# EAGLE schematic Calciatore Rev.2 DOWN (EAGLE 7.2.0)

## Sheet 1 of 3
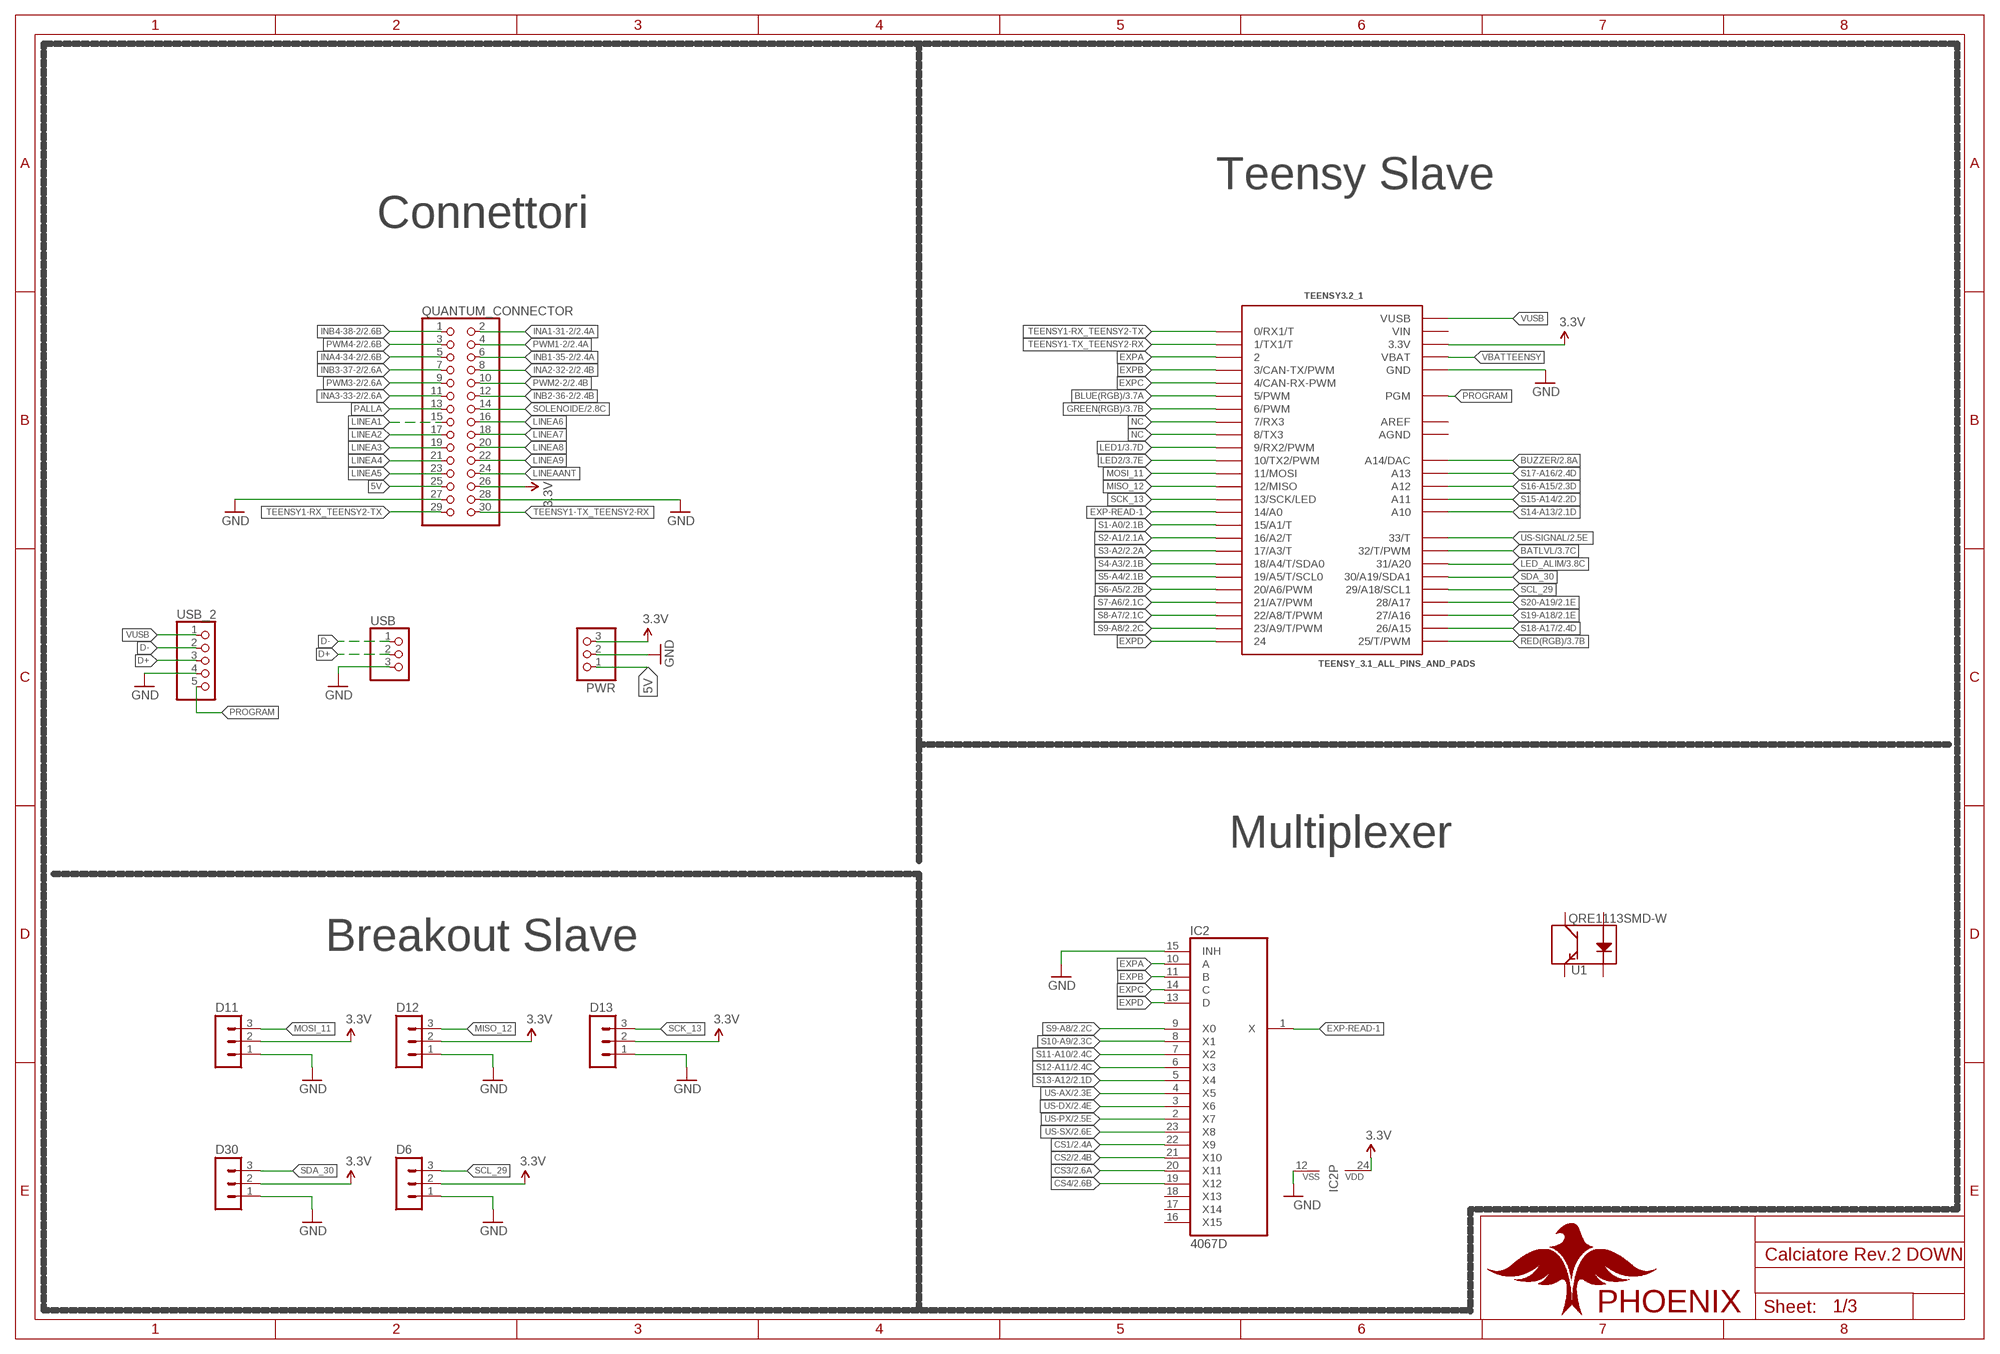
[diagram p0: schematic, sheet 1]

### Parts
D6  MA03-1  [MA03-1]
D11  MA03-1  [MA03-1]
D12  MA03-1  [MA03-1]
D13  MA03-1  [MA03-1]
D30  MA03-1  [MA03-1]
IC2  4067D  [SO24W]
PWR  PINHD-1X3  [1X03]
QUANTUM_CONNECTOR  PINHD-2X15  [2X15]
TEENSY3.2_1  TEENSY_3.1_ALL_PINS_AND_PADS  [TEENSY3_ALL_PINS_&_PADS]
U1  QRE1113SMD-W  [QRE1113-W]
USB  PINHD-1X3  [1X03]
USB_2  PINHD-1X5  [1X05]

### Nets
3.3V [power usb]: D6.2 D11.2 D12.2 D13.2 D30.2 IC2.24(VDD) PWR.3 QUANTUM_CONNECTOR.26 TEENSY3.2_1.3.3V TEENSY3.2_1.3.3V1(3.3V) TEENSY3.2_1.3.3V2(3.3V) ; also sheet 2,3
5V: PWR.1 QUANTUM_CONNECTOR.25 ; also sheet 3
BATLVL: TEENSY3.2_1.32(32/T/PWM) ; also sheet 3
BLUE(RGB): TEENSY3.2_1.5(5/PWM) ; also sheet 3
BUZZER: TEENSY3.2_1.RESET/DAC(A14/DAC) ; also sheet 2
CS1: IC2.22(X9) ; also sheet 2
CS2: IC2.21(X10) ; also sheet 2
CS3: IC2.20(X11) ; also sheet 2
CS4: IC2.19(X12) ; also sheet 2
D+: USB.2 USB_2.3
D-: USB.1 USB_2.2
EXP-READ-1: IC2.1(X) TEENSY3.2_1.14/A0
EXPA: IC2.10(A) TEENSY3.2_1.2
EXPB: IC2.11(B) TEENSY3.2_1.3(3/CAN-TX/PWM)
EXPC: IC2.14(C) TEENSY3.2_1.4(4/CAN-RX-PWM)
EXPD: IC2.13(D) TEENSY3.2_1.24
GND [gnd]: D6.1 D11.1 D12.1 D13.1 D30.1 IC2.12(VSS) IC2.15(INH) PWR.2 QUANTUM_CONNECTOR.27 QUANTUM_CONNECTOR.28 TEENSY3.2_1.GND TEENSY3.2_1.GND1(GND) TEENSY3.2_1.GND2(GND) USB.3 USB_2.4 ; also sheet 2,3
GREEN(RGB): TEENSY3.2_1.6(6/PWM) ; also sheet 3
INA1-31-2: QUANTUM_CONNECTOR.2 ; also sheet 2
INA2-32-2: QUANTUM_CONNECTOR.8 ; also sheet 2
INA3-33-2: QUANTUM_CONNECTOR.11 ; also sheet 2
INA4-34-2: QUANTUM_CONNECTOR.5 ; also sheet 2
INB1-35-2: QUANTUM_CONNECTOR.6 ; also sheet 2
INB2-36-2: QUANTUM_CONNECTOR.12 ; also sheet 2
INB3-37-2: QUANTUM_CONNECTOR.7 ; also sheet 2
INB4-38-2: QUANTUM_CONNECTOR.1 ; also sheet 2
LED1: TEENSY3.2_1.9(9/RX2/PWM) ; also sheet 3
LED2: TEENSY3.2_1.10(10/TX2/PWM) ; also sheet 3
LED_ALIM: TEENSY3.2_1.31(31/A20) ; also sheet 3
LINEA1: QUANTUM_CONNECTOR.15
LINEA2: QUANTUM_CONNECTOR.17
LINEA3: QUANTUM_CONNECTOR.19
LINEA4: QUANTUM_CONNECTOR.21
LINEA5: QUANTUM_CONNECTOR.23
LINEA6: QUANTUM_CONNECTOR.16
LINEA7: QUANTUM_CONNECTOR.18
LINEA8: QUANTUM_CONNECTOR.20
LINEA9: QUANTUM_CONNECTOR.22
LINEAANT: QUANTUM_CONNECTOR.24
MISO_12: D12.3 TEENSY3.2_1.12(12/MISO)
MOSI_11: D11.3 TEENSY3.2_1.11(11/MOSI)
NC: TEENSY3.2_1.7(7/RX3) TEENSY3.2_1.8(8/TX3)
PALLA: QUANTUM_CONNECTOR.13
PROGRAM: TEENSY3.2_1.PGM USB_2.5
PWM1-2: QUANTUM_CONNECTOR.4 ; also sheet 2
PWM2-2: QUANTUM_CONNECTOR.10 ; also sheet 2
PWM3-2: QUANTUM_CONNECTOR.9 ; also sheet 2
PWM4-2: QUANTUM_CONNECTOR.3 ; also sheet 2
RED(RGB): TEENSY3.2_1.25(25/T/PWM) ; also sheet 3
S1-A0: TEENSY3.2_1.15/A1(15/A1/T) ; also sheet 2
S2-A1: TEENSY3.2_1.16/A2(16/A2/T) ; also sheet 2
S3-A2: TEENSY3.2_1.17/A3(17/A3/T) ; also sheet 2
S4-A3: TEENSY3.2_1.18/A4(18/A4/T/SDA0) ; also sheet 2
S5-A4: TEENSY3.2_1.19/A5(19/A5/T/SCL0) ; also sheet 2
S6-A5: TEENSY3.2_1.20/A6(20/A6/PWM) ; also sheet 2
S7-A6: TEENSY3.2_1.21/A7(21/A7/PWM) ; also sheet 2
S8-A7: TEENSY3.2_1.22/A8(22/A8/T/PWM) ; also sheet 2
S9-A8: IC2.9(X0) TEENSY3.2_1.23/A9(23/A9/T/PWM) ; also sheet 2
S10-A9: IC2.8(X1) ; also sheet 2
S11-A10: IC2.7(X2) ; also sheet 2
S12-A11: IC2.6(X3) ; also sheet 2
S13-A12: IC2.5(X4) ; also sheet 2
S14-A13: TEENSY3.2_1.A10 ; also sheet 2
S15-A14: TEENSY3.2_1.A11 ; also sheet 2
S16-A15: TEENSY3.2_1.A12 ; also sheet 2
S17-A16: TEENSY3.2_1.A13 ; also sheet 2
S18-A17: TEENSY3.2_1.26(26/A15) ; also sheet 2
S19-A18: TEENSY3.2_1.27(27/A16) ; also sheet 2
S20-A19: TEENSY3.2_1.28(28/A17) ; also sheet 2
SCK_13: D13.3 TEENSY3.2_1.13(13/SCK/LED)
SCL_29: D6.3 TEENSY3.2_1.29(29/A18/SCL1)
SDA_30: D30.3 TEENSY3.2_1.30(30/A19/SDA1)
SOLENOIDE: QUANTUM_CONNECTOR.14 ; also sheet 2
TEENSY1-RX_TEENSY2-TX: QUANTUM_CONNECTOR.29 TEENSY3.2_1.0(0/RX1/T)
TEENSY1-TX_TEENSY2-RX: QUANTUM_CONNECTOR.30 TEENSY3.2_1.1(1/TX1/T)
US-AX: IC2.4(X5) ; also sheet 2
US-DX: IC2.3(X6) ; also sheet 2
US-PX: IC2.2(X7) ; also sheet 2
US-SIGNAL: TEENSY3.2_1.33(33/T) ; also sheet 2
US-SX: IC2.23(X8) ; also sheet 2
VBATTEENSY: TEENSY3.2_1.VBAT
VUSB: TEENSY3.2_1.VUSB USB_2.1
Unconnected: IC2.16(X15) IC2.17(X14) IC2.18(X13) U1.1(A) U1.2(K) U1.3(C) U1.4(E)

### Notes on the sheet
- Teensy Slave
- Connettori
- Multiplexer
- Breakout Slave
- PHOENIX

## Sheet 2 of 3
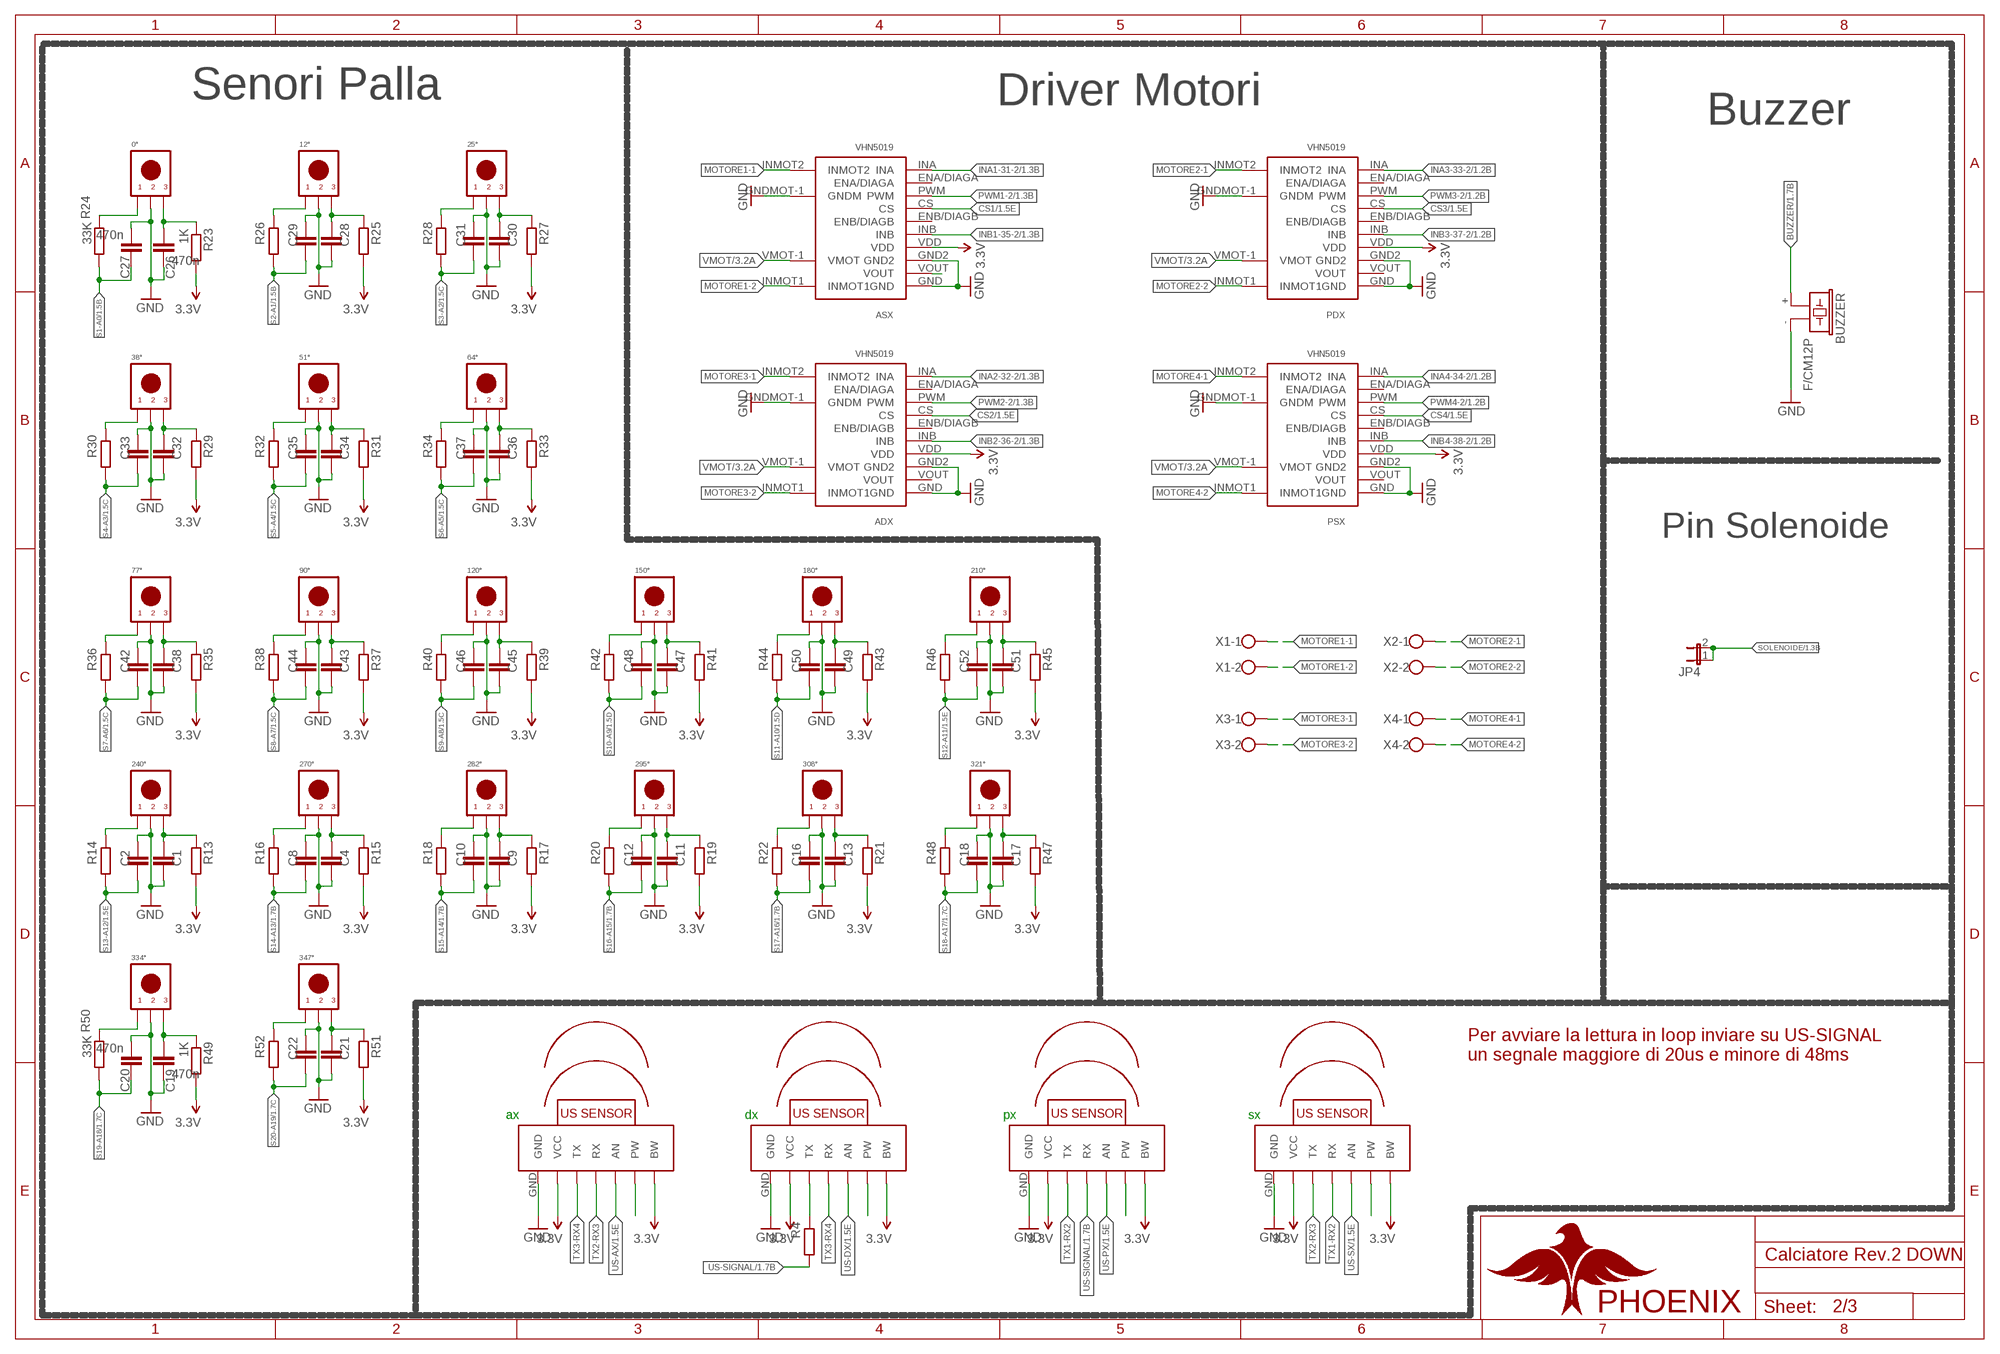
[diagram p1: schematic, sheet 2]

### Parts
0°  effe  TSOP4840  [TSOP4840]
12°  effe  TSOP4840  [TSOP4840]
25°  effe  TSOP4840  [TSOP4840]
38°  effe  TSOP4840  [TSOP4840]
51°  effe  TSOP4840  [TSOP4840]
64°  effe  TSOP4840  [TSOP4840]
77°  effe  TSOP4840  [TSOP4840]
90°  effe  TSOP4840  [TSOP4840]
120°  effe  TSOP4840  [TSOP4840]
150°  effe  TSOP4840  [TSOP4840]
180°  effe  TSOP4840  [TSOP4840]
210°  effe  TSOP4840  [TSOP4840]
240°  effe  TSOP4840  [TSOP4840]
270°  effe  TSOP4840  [TSOP4840]
282°  effe  TSOP4840  [TSOP4840]
295°  effe  TSOP4840  [TSOP4840]
308°  effe  TSOP4840  [TSOP4840]
321°  effe  TSOP4840  [TSOP4840]
334°  effe  TSOP4840  [TSOP4840]
347°  effe  TSOP4840  [TSOP4840]
ADX  VHN5019  [MOTOR-SHIELD]
ASX  VHN5019  [MOTOR-SHIELD]
AX  MB1010  [MB1010]
BUZZER  F/CM12P  [F/CM12P]
C1  C-EUC1206  [C1206]
C2  C-EUC1206  [C1206]
C4  C-EUC1206  [C1206]
C8  C-EUC1206  [C1206]
C9  C-EUC1206  [C1206]
C10  C-EUC1206  [C1206]
C11  C-EUC1206  [C1206]
C12  C-EUC1206  [C1206]
C13  C-EUC1206  [C1206]
C16  C-EUC1206  [C1206]
C17  C-EUC1206  [C1206]
C18  C-EUC1206  [C1206]
C19  470n  C-EUC1206  [C1206]
C20  470n  C-EUC1206  [C1206]
C21  C-EUC1206  [C1206]
C22  C-EUC1206  [C1206]
C26  470n  C-EUC1206  [C1206]
C27  470n  C-EUC1206  [C1206]
C28  C-EUC1206  [C1206]
C29  C-EUC1206  [C1206]
C30  C-EUC1206  [C1206]
C31  C-EUC1206  [C1206]
C32  C-EUC1206  [C1206]
C33  C-EUC1206  [C1206]
C34  C-EUC1206  [C1206]
C35  C-EUC1206  [C1206]
C36  C-EUC1206  [C1206]
C37  C-EUC1206  [C1206]
C38  C-EUC1206  [C1206]
C42  C-EUC1206  [C1206]
C43  C-EUC1206  [C1206]
C44  C-EUC1206  [C1206]
C45  C-EUC1206  [C1206]
C46  C-EUC1206  [C1206]
C47  C-EUC1206  [C1206]
C48  C-EUC1206  [C1206]
C49  C-EUC1206  [C1206]
C50  C-EUC1206  [C1206]
C51  C-EUC1206  [C1206]
C52  C-EUC1206  [C1206]
DX  MB1010  [MB1010]
JP4  JP1E  [JP1]
PDX  VHN5019  [MOTOR-SHIELD]
PSX  VHN5019  [MOTOR-SHIELD]
PX  MB1010  [MB1010]
R4  R-EU_M1206  [M1206]
R13  R-EU_M1206  [M1206]
R14  R-EU_M1206  [M1206]
R15  R-EU_M1206  [M1206]
R16  R-EU_M1206  [M1206]
R17  R-EU_M1206  [M1206]
R18  R-EU_M1206  [M1206]
R19  R-EU_M1206  [M1206]
R20  R-EU_M1206  [M1206]
R21  R-EU_M1206  [M1206]
R22  R-EU_M1206  [M1206]
R23  1K  R-EU_M1206  [M1206]
R24  33K  R-EU_M1206  [M1206]
R25  R-EU_M1206  [M1206]
R26  R-EU_M1206  [M1206]
R27  R-EU_M1206  [M1206]
R28  R-EU_M1206  [M1206]
R29  R-EU_M1206  [M1206]
R30  R-EU_M1206  [M1206]
R31  R-EU_M1206  [M1206]
R32  R-EU_M1206  [M1206]
R33  R-EU_M1206  [M1206]
R34  R-EU_M1206  [M1206]
R35  R-EU_M1206  [M1206]
R36  R-EU_M1206  [M1206]
R37  R-EU_M1206  [M1206]
R38  R-EU_M1206  [M1206]
R39  R-EU_M1206  [M1206]
R40  R-EU_M1206  [M1206]
R41  R-EU_M1206  [M1206]
R42  R-EU_M1206  [M1206]
R43  R-EU_M1206  [M1206]
R44  R-EU_M1206  [M1206]
R45  R-EU_M1206  [M1206]
R46  R-EU_M1206  [M1206]
R47  R-EU_M1206  [M1206]
R48  R-EU_M1206  [M1206]
R49  1K  R-EU_M1206  [M1206]
R50  33K  R-EU_M1206  [M1206]
R51  R-EU_M1206  [M1206]
R52  R-EU_M1206  [M1206]
SX  MB1010  [MB1010]
X1  W237-102  [W237-102]
X2  W237-102  [W237-102]
X3  W237-102  [W237-102]
X4  W237-102  [W237-102]

### Nets
3.3V [power usb]: ADX.VDD ASX.VDD AX.BW AX.VCC DX.BW DX.VCC PDX.VDD PSX.VDD PX.BW PX.VCC R13.2 R15.2 R17.2 R19.2 R21.2 R23.2 R25.2 R27.2 R29.2 R31.2 R33.2 R35.2 R37.2 R39.2 R41.2 R43.2 R45.2 R47.2 R49.2 R51.2 SX.BW SX.VCC ; also sheet 1,3
BUZZER: BUZZER.+ ; also sheet 1
CS1: ASX.CS ; also sheet 1
CS2: ADX.CS ; also sheet 1
CS3: PDX.CS ; also sheet 1
CS4: PSX.CS ; also sheet 1
GND [gnd]: 0°.GND 12°.GND 25°.GND 38°.GND 51°.GND 64°.GND 77°.GND 90°.GND 120°.GND 150°.GND 180°.GND 210°.GND 240°.GND 270°.GND 282°.GND 295°.GND 308°.GND 321°.GND 334°.GND 347°.GND ADX.GND ADX.GND2 ADX.GNDMOT-1(GNDM) ASX.GND ASX.GND2 ASX.GNDMOT-1(GNDM) AX.GND BUZZER.- C1.2 C2.1 C4.2 C8.1 C9.2 C10.1 C11.2 C12.1 C13.2 C16.1 C17.2 C18.1 C19.2 C20.2 C21.2 C22.1 C26.2 C27.2 C28.2 C29.1 C30.2 C31.1 C32.2 C33.1 C34.2 C35.1 C36.2 C37.1 C38.2 C42.1 C43.2 C44.1 C45.2 C46.1 C47.2 C48.1 C49.2 C50.1 C51.2 C52.1 DX.GND PDX.GND PDX.GND2 PDX.GNDMOT-1(GNDM) PSX.GND PSX.GND2 PSX.GNDMOT-1(GNDM) PX.GND SX.GND ; also sheet 1,3
INA1-31-2: ASX.INA ; also sheet 1
INA2-32-2: ADX.INA ; also sheet 1
INA3-33-2: PDX.INA ; also sheet 1
INA4-34-2: PSX.INA ; also sheet 1
INB1-35-2: ASX.INB ; also sheet 1
INB2-36-2: ADX.INB ; also sheet 1
INB3-37-2: PDX.INB ; also sheet 1
INB4-38-2: PSX.INB ; also sheet 1
MOTORE1-1: ASX.INMOT2 X1.1
MOTORE1-2: ASX.INMOT1 X1.2
MOTORE2-1: PDX.INMOT2 X2.1
MOTORE2-2: PDX.INMOT1 X2.2
MOTORE3-1: ADX.INMOT2 X3.1
MOTORE3-2: ADX.INMOT1 X3.2
MOTORE4-1: PSX.INMOT2 X4.1
MOTORE4-2: PSX.INMOT1 X4.2
N$3: 0°.VCC C26.1 R23.1
N$4: 0°.OUT R24.1
N$6: 12°.VCC C28.1 R25.1
N$7: 12°.OUT R26.1
N$9: 240°.VCC C1.1 R13.1
N$12 [power usb]: PX.PW
N$13: 270°.VCC C4.1 R15.1
N$14: 282°.VCC C9.1 R17.1
N$15: 25°.OUT R28.1
N$16: 38°.OUT R30.1
N$18: 51°.OUT R32.1
N$20: 25°.VCC C30.1 R27.1
N$24: 295°.VCC C11.1 R19.1
N$25: 308°.VCC C13.1 R21.1
N$26: 321°.VCC C17.1 R47.1
N$27: 64°.OUT R34.1
N$28: 38°.VCC C32.1 R29.1
N$34: 77°.OUT R36.1
N$35: 51°.VCC C34.1 R31.1
N$36: 120°.OUT R40.1
N$37: 64°.VCC C36.1 R33.1
N$38: 180°.OUT R44.1
N$39: 77°.VCC C38.1 R35.1
N$40: 90°.OUT R38.1
N$41: 90°.VCC C43.1 R37.1
N$42: 150°.OUT R42.1
N$43: 120°.VCC C45.1 R39.1
N$44: 210°.OUT R46.1
N$45: 150°.VCC C47.1 R41.1
N$51: 240°.OUT R14.1
N$52: 180°.VCC C49.1 R43.1
N$53: 270°.OUT R16.1
N$54: 210°.VCC C51.1 R45.1
N$56: 282°.OUT R18.1
N$57: 295°.OUT R20.1
N$60: 308°.OUT R22.1
N$65: 321°.OUT R48.1
N$190: 334°.VCC C19.1 R49.1
N$191: 347°.VCC C21.1 R51.1
N$200: AX.PW
N$201: 334°.OUT R50.1
N$202: 347°.OUT R52.1
N$215: DX.TX R4.1
N$233: DX.PW
N$366: SX.PW
PWM1-2: ASX.PWM ; also sheet 1
PWM2-2: ADX.PWM ; also sheet 1
PWM3-2: PDX.PWM ; also sheet 1
PWM4-2: PSX.PWM ; also sheet 1
S1-A0: C27.1 R24.2 ; also sheet 1
S2-A1: C29.2 R26.2 ; also sheet 1
S3-A2: C31.2 R28.2 ; also sheet 1
S4-A3: C33.2 R30.2 ; also sheet 1
S5-A4: C35.2 R32.2 ; also sheet 1
S6-A5: C37.2 R34.2 ; also sheet 1
S7-A6: C42.2 R36.2 ; also sheet 1
S8-A7: C44.2 R38.2 ; also sheet 1
S9-A8: C46.2 R40.2 ; also sheet 1
S10-A9: C48.2 R42.2 ; also sheet 1
S11-A10: C50.2 R44.2 ; also sheet 1
S12-A11: C52.2 R46.2 ; also sheet 1
S13-A12: C2.2 R14.2 ; also sheet 1
S14-A13: C8.2 R16.2 ; also sheet 1
S15-A14: C10.2 R18.2 ; also sheet 1
S16-A15: C12.2 R20.2 ; also sheet 1
S17-A16: C16.2 R22.2 ; also sheet 1
S18-A17: C18.2 R48.2 ; also sheet 1
S19-A18: C20.1 R50.2 ; also sheet 1
S20-A19: C22.2 R52.2 ; also sheet 1
SOLENOIDE: JP4.1 JP4.2 ; also sheet 1
TX1-RX2: PX.TX SX.RX
TX2-RX3: AX.RX SX.TX
TX3-RX4: AX.TX DX.RX
US-AX: AX.AN ; also sheet 1
US-DX: DX.AN ; also sheet 1
US-PX: PX.AN ; also sheet 1
US-SIGNAL: PX.RX R4.2 ; also sheet 1
US-SX: SX.AN ; also sheet 1
VMOT [power]: ADX.VMOT-1(VMOT) ASX.VMOT-1(VMOT) PDX.VMOT-1(VMOT) PSX.VMOT-1(VMOT) ; also sheet 3
VOUT: ASX.VOUT
Unconnected: ADX.ENA/DIAGA ADX.ENB/DIAGB ADX.VOUT ASX.ENA/DIAGA ASX.ENB/DIAGB PDX.ENA/DIAGA PDX.ENB/DIAGB PDX.VOUT PSX.ENA/DIAGA PSX.ENB/DIAGB PSX.VOUT

### Notes on the sheet
- Senori Palla
- Driver Motori
- Buzzer
- Pin Solenoide
- Per avviare la lettura in loop inviare su US-SIGNAL
  un segnale maggiore di 20us e minore di 48ms
- ax | dx | px | sx
- PHOENIX

## Sheet 3 of 3
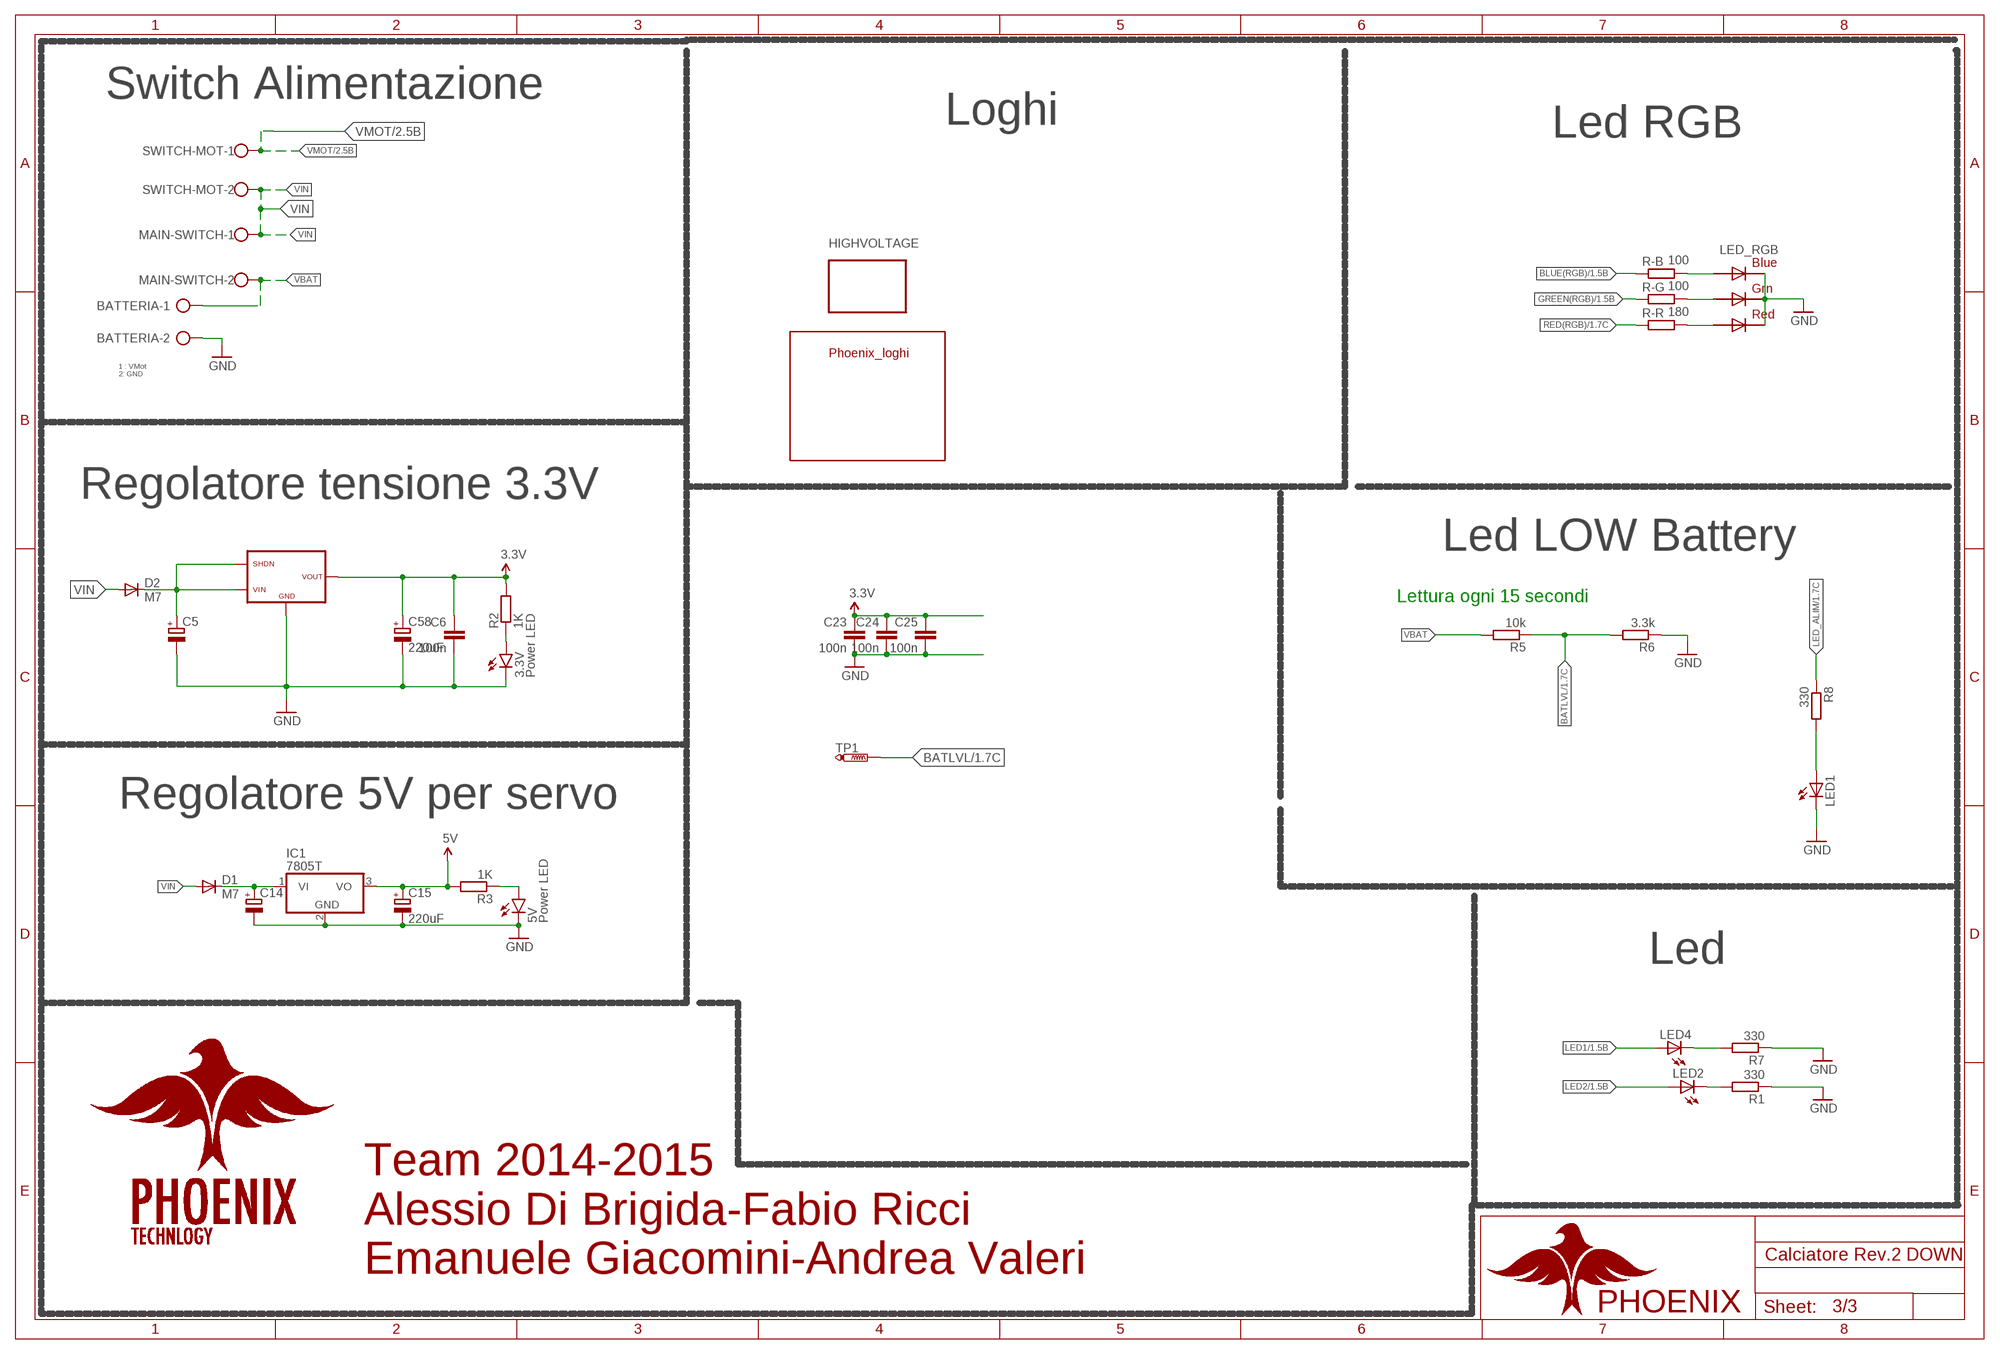
[diagram p2: schematic, sheet 3]

### Parts
3.3V  Power LED  LED-FKIT-1206  [FKIT-LED-1206]
5V  Power LED  LED-FKIT-1206  [FKIT-LED-1206]
BATTERIA  AK500/2-H  [AK500/2-H]
C5  CPOL-EUE5-8.5  [E5-8,5]
C6  100n  CC1206  [C1206]
C14  CPOL-EUE5-8.5  [E5-8,5]
C15  220uF  CPOL-EUE5-8.5  [E5-8,5]
C23  100n  CC1206  [C1206]
C24  100n  CC1206  [C1206]
C25  100n  CC1206  [C1206]
C58  220uF  CPOL-EUE5-8.5  [E5-8,5]
D1  M7  DIODE-SMB  [SMB]
D2  M7  DIODE-SMB  [SMB]
HIGHVOLTAGE  LOGO  [LOGOHV]
IC1  7805T  [TO220H]
LED1  LEDSMT1206  [1206]
LED2  LEDSMT1206  [1206]
LED4  LEDSMT1206  [1206]
LED_RGB  RGBLED5050  [RGBLED5050]
MAIN-SWITCH  W237-102  [W237-102]
R1  330  R-EU_M1206  [M1206]
R2  1K  R-EU_M1206  [M1206]
R3  1K  R-EU_M1206  [M1206]
R5  10k  R-EU_M1206  [M1206]
R6  3.3k  R-EU_M1206  [M1206]
R7  330  R-EU_M1206  [M1206]
R8  330  R-EU_M1206  [M1206]
R-B  100  R-EU_M1206  [M1206]
R-G  100  R-EU_M1206  [M1206]
R-R  180  R-EU_M1206  [M1206]
SWITCH-MOT  W237-102  [W237-102]
TP1  PTR1TP17SQ  [TP17SQ]
U$8  PHOENIX_LOGHI  [PHOENIX_LOGHI]
U$10  ALIM  [ALIM_SWITCHING]

### Nets
3.3V [power usb]: C6.1 C23.1 C24.1 C25.1 C58.+ R2.2 U$10.VOUT ; also sheet 1,2
5V: C15.+ IC1.3(VO) R3.2 ; also sheet 1
BATLVL: R5.1 R6.2 TP1.TP ; also sheet 1
BLUE(RGB): R-B.1 ; also sheet 1
GND [gnd]: 3.3V.C 5V.C BATTERIA.2 C5.- C6.2 C14.- C15.- C23.2 C24.2 C25.2 C58.- IC1.2(GND) LED1.C LED_RGB.4(BLUE_C) LED_RGB.5(RED_C) LED_RGB.6(GREEN_C) R1.1 R6.1 R7.1 U$10.GND ; also sheet 1,2
GREEN(RGB): R-G.1 ; also sheet 1
LED1: LED4.A ; also sheet 1
LED2: LED2.A ; also sheet 1
LED_ALIM: R8.1 ; also sheet 1
N$1: LED2.C R1.2
N$2: LED1.A R8.2
N$17 [power]: C5.+ D2.C U$10.SHDN U$10.VIN
N$64: 3.3V.A R2.1
N$67: LED_RGB.3(BLUE_A) R-B.2
N$68: LED_RGB.1(GREEN_A) R-G.2
N$69: LED4.C R7.2
N$81: LED_RGB.2(RED_A) R-R.2
N$95: C14.+ D1.C IC1.1(VI)
N$97: 5V.A R3.1
RED(RGB): R-R.1 ; also sheet 1
VBAT [power]: BATTERIA.1 MAIN-SWITCH.2 R5.2
VIN [power]: D1.A D2.A MAIN-SWITCH.1 SWITCH-MOT.2
VMOT [power]: SWITCH-MOT.1 ; also sheet 2

### Notes on the sheet
- Switch Alimentazione
- Loghi | Led RGB
- 1 : VMot
  2: GND
- Regolatore tensione 3.3V
- Led LOW Battery
- Lettura ogni 15 secondi
- Regolatore 5V per servo
- Led
- Team 2014-2015
  Alessio Di Brigida-Fabio Ricci
  Emanuele Giacomini-Andrea Valeri
- PHOENIX

## Power pins joined to a net without a drawn wire
AGND: TEENSY3.2_1.AGND
AREF: TEENSY3.2_1.AREF
VIN: TEENSY3.2_1.VIN

## Library data of the parts
0° 12° 25° 38° 51° 64° 77° 90° 120° 150° 180° 210° 240° 270° 282° 295° 308° 321° 334° 347° = TSOP4840 IR:TSOP4840: FEATURES • Low supply current • Photo detector and preamplifier in one package • Internal filter for PCM frequency • Improved shielding against EMI • Supply voltage: 2.7 V to 5.5 V • Improved immunity against ambient light • Insensitive to supply voltage ripple and noise • Material categorization: For definitions of compliance please see www.vishay.com/doc?99912 DESCRIPTION These products are miniaturized receivers for infrared remote control systems. A PIN diode and a preamplifier are assembled on a lead frame, the epoxy package acts as an IR filter. The demodulated output signal can be directly decoded by a microprocessor. The TSOP22.., TSOP48.. are compatible with all common IR remote control data formats. The TSOP24.., TSOP44.. are optimized to suppress almost all spurious pulses from energy saving fluorescent lamps but will also suppress some data signals. This component has not been qualified according to automotive specifications.
3.3V 5V = SparkFun-LED:LED: LEDs Standard schematic elements and footprints for 5mm, 3mm, 1206, and 0603 sized LEDs. 5mm - Spark Fun Electronics SKU : COM-00529 (and others)
ADX ASX PDX PSX = VHN5019:VHN5019: Operating voltage: 5.5 – 24 V1 Output current: 12 A continuous (30 maximum) 3V-compatible inputs PWM operation up to 20 kHz, which is ultrasonic and allows for quieter motor operation Current sense output proportional to motor current (approx. 140 mV/A) Motor indicator LEDs (indicates what the outputs are doing even when no motor is connected) Robust: Reverse-voltage protection Can survive input voltages up to 41 V Undervoltage and overvoltage shutdown High-side and low-side thermal shutdown Short-to-ground and short-to-Vcc protection; MOTOR: motor
AX DX PX SX = MaxSonar-mb1010:MB1010
BATTERIA = con-ptr500:AK500/2-H: CONNECTOR Aug. 2004 / PTR Meßtechnik: Die Bezeichnung der Serie AK505 wurde geändert. Es handelt sich hierbei um AK500 in horizontaler Ausführung.; OC_FARNELL: unknown; OC_NEWARK: unknown
BUZZER = buzzer:F/CM12P: BUZZER Source: Buerklin; OC_FARNELL: unknown; OC_NEWARK: unknown
C1 C2 C4 C8-C13 C16-C22 C26-C38 C42-C52 = rcl:C-EU: CAPACITOR, European symbol
C5 C14 C15 C58 = resistor:CPOL-EU: POLARIZED CAPACITOR, European symbol
C6 C23-C25 = eagle-ltspice:C: CAPACITOR, European symbol; SPICEMODEL: NONE; SPICEPREFIX: C
D1 D2 = diode:DIODE-: DIODE
D6 D11-D13 D30 = con-lstb:MA03-1: PIN HEADER; OC_FARNELL: unknown; OC_NEWARK: unknown
HIGHVOLTAGE = Loghi:LOGO
IC1 = linear:78*: Positive VOLTAGE REGULATOR Source: http://cache.national.com/ds/LM/LM78L05.pdf http://www.fairchildsemi.com/ds/LM/LM7805.pdf
IC2 = 40xx:4067: 16-channel ANALOG MULTIPLEXER
JP4 = jumper:JP1E: JUMPER
LED1 LED2 LED4 = adafruit:LED: LED OSRAM: - CHIPLED LG R971, LG N971, LY N971, LG Q971, LY Q971, LO R971, LY R971 LH N974, LH R974 LS Q976, LO Q976, LY Q976 LO Q996 - Hyper CHIPLED LW Q18S LB Q993, LB Q99A, LB R99A - SideLED LS A670, LO A670, LY A670, LG A670, LP A670 LB A673, LV A673, LT A673, LW A673 LH A674 LY A675 LS A676, LA A676, LO A676, LY A676, LW A676 LS A679, LY A679, LG A679 - Hyper Micro SIDELED® LS Y876, LA Y876, LO Y876, LY Y876 LT Y87S - SmartLED LW L88C, LW L88S LB L89C, LB L89S, LG L890 LS L89K, LO L89K, LY L89K LS L896, LA L896, LO L896, LY L896 - TOPLED LS T670, LO T670, LY T670, LG T670, LP T670 LSG T670, LSP T670, LSY T670, LOP T670, LYG T670 LG T671, LOG T671, LSG T671 LB T673, LV T673, LT T673, LW T673 LH T674 LS T676, LA T676, LO T676, LY T676, LB T676, LH T676, LSB T676, LW T676 LB T67C, LV T67C, LT T67C, LS T67K, LO T67K, LY T67K, LW E67C LS E67B, LA E67B, LO E67B, LY E67B, LB E67C, LV E67C, LT E67C LW T67C LS T679, LY T679, LG T679 LS T770, LO T770, LY T770, LG T770, LP T770 LB T773, LV T773, LT T773, LW T773 LH T774 LS E675, LA E675, LY E675, LS T675 LS T776, LA T776, LO T776, LY T776, LB T776 LHGB T686 LT T68C, LB T68C - Hyper Mini TOPLED® LB M676 - Mini TOPLED Santana® LG M470 LS M47K, LO M47K, LY M47K Source: http://www.osram.convergy.de/
LED_RGB = adafruit:RGBLED: For 5050 RGB LEDs, the order of the LEDs may vary from one manufacturer to another!
MAIN-SWITCH SWITCH-MOT X1-X4 = con-wago-500:W237-102: WAGO SCREW CLAMP; MPN: 237-102; OC_FARNELL: unknown; OC_NEWARK: 70K9898
PWR USB = pinhead:PINHD-1X3: PIN HEADER
QUANTUM_CONNECTOR = pinhead:PINHD-2X15: PIN HEADER
R1-R3 R5-R8 R-B R-G R-R = resistor:R-EU_: RESISTOR, European symbol
R4 R13-R52 = rcl:R-EU_: RESISTOR, European symbol
TEENSY3.2_1 = Teensy_3_and_LC_Series_Boards_v1.1:TEENSY_3.1_ALL_PINS_AND_PADS: Footprint for Teensy 3.1 or 3.2 board using all pads and all through-holes. Pads need a 2x7 0.1" SMD header.
TP1 = testpad:PTR1: TEST PIN
U1 = SparkFun-Sensors:QRE1113: Reflective object sensor
U$8 = loghi_phoenix:PHOENIX_LOGHI
U$10 = Pololu switching alimentatore:ALIM
USB_2 = pinhead:PINHD-1X5: PIN HEADER

## Net classes
0 default: width 0.254 mm, drill 0.254 mm, clearance 0.203 mm
1 power: width 1.016 mm, drill 0.889 mm, clearance 0.508 mm
2 gnd: width 0.864 mm, drill 0.406 mm, clearance 0.381 mm
3 power usb: width 0.305 mm, drill 0.406 mm, clearance 0.203 mm